# Altium schematic sheet proj_patrusheva_control_board_1.SchDoc: =title_line_1 + title_line_2
size 840 x 594 mm; SheetNumber: n
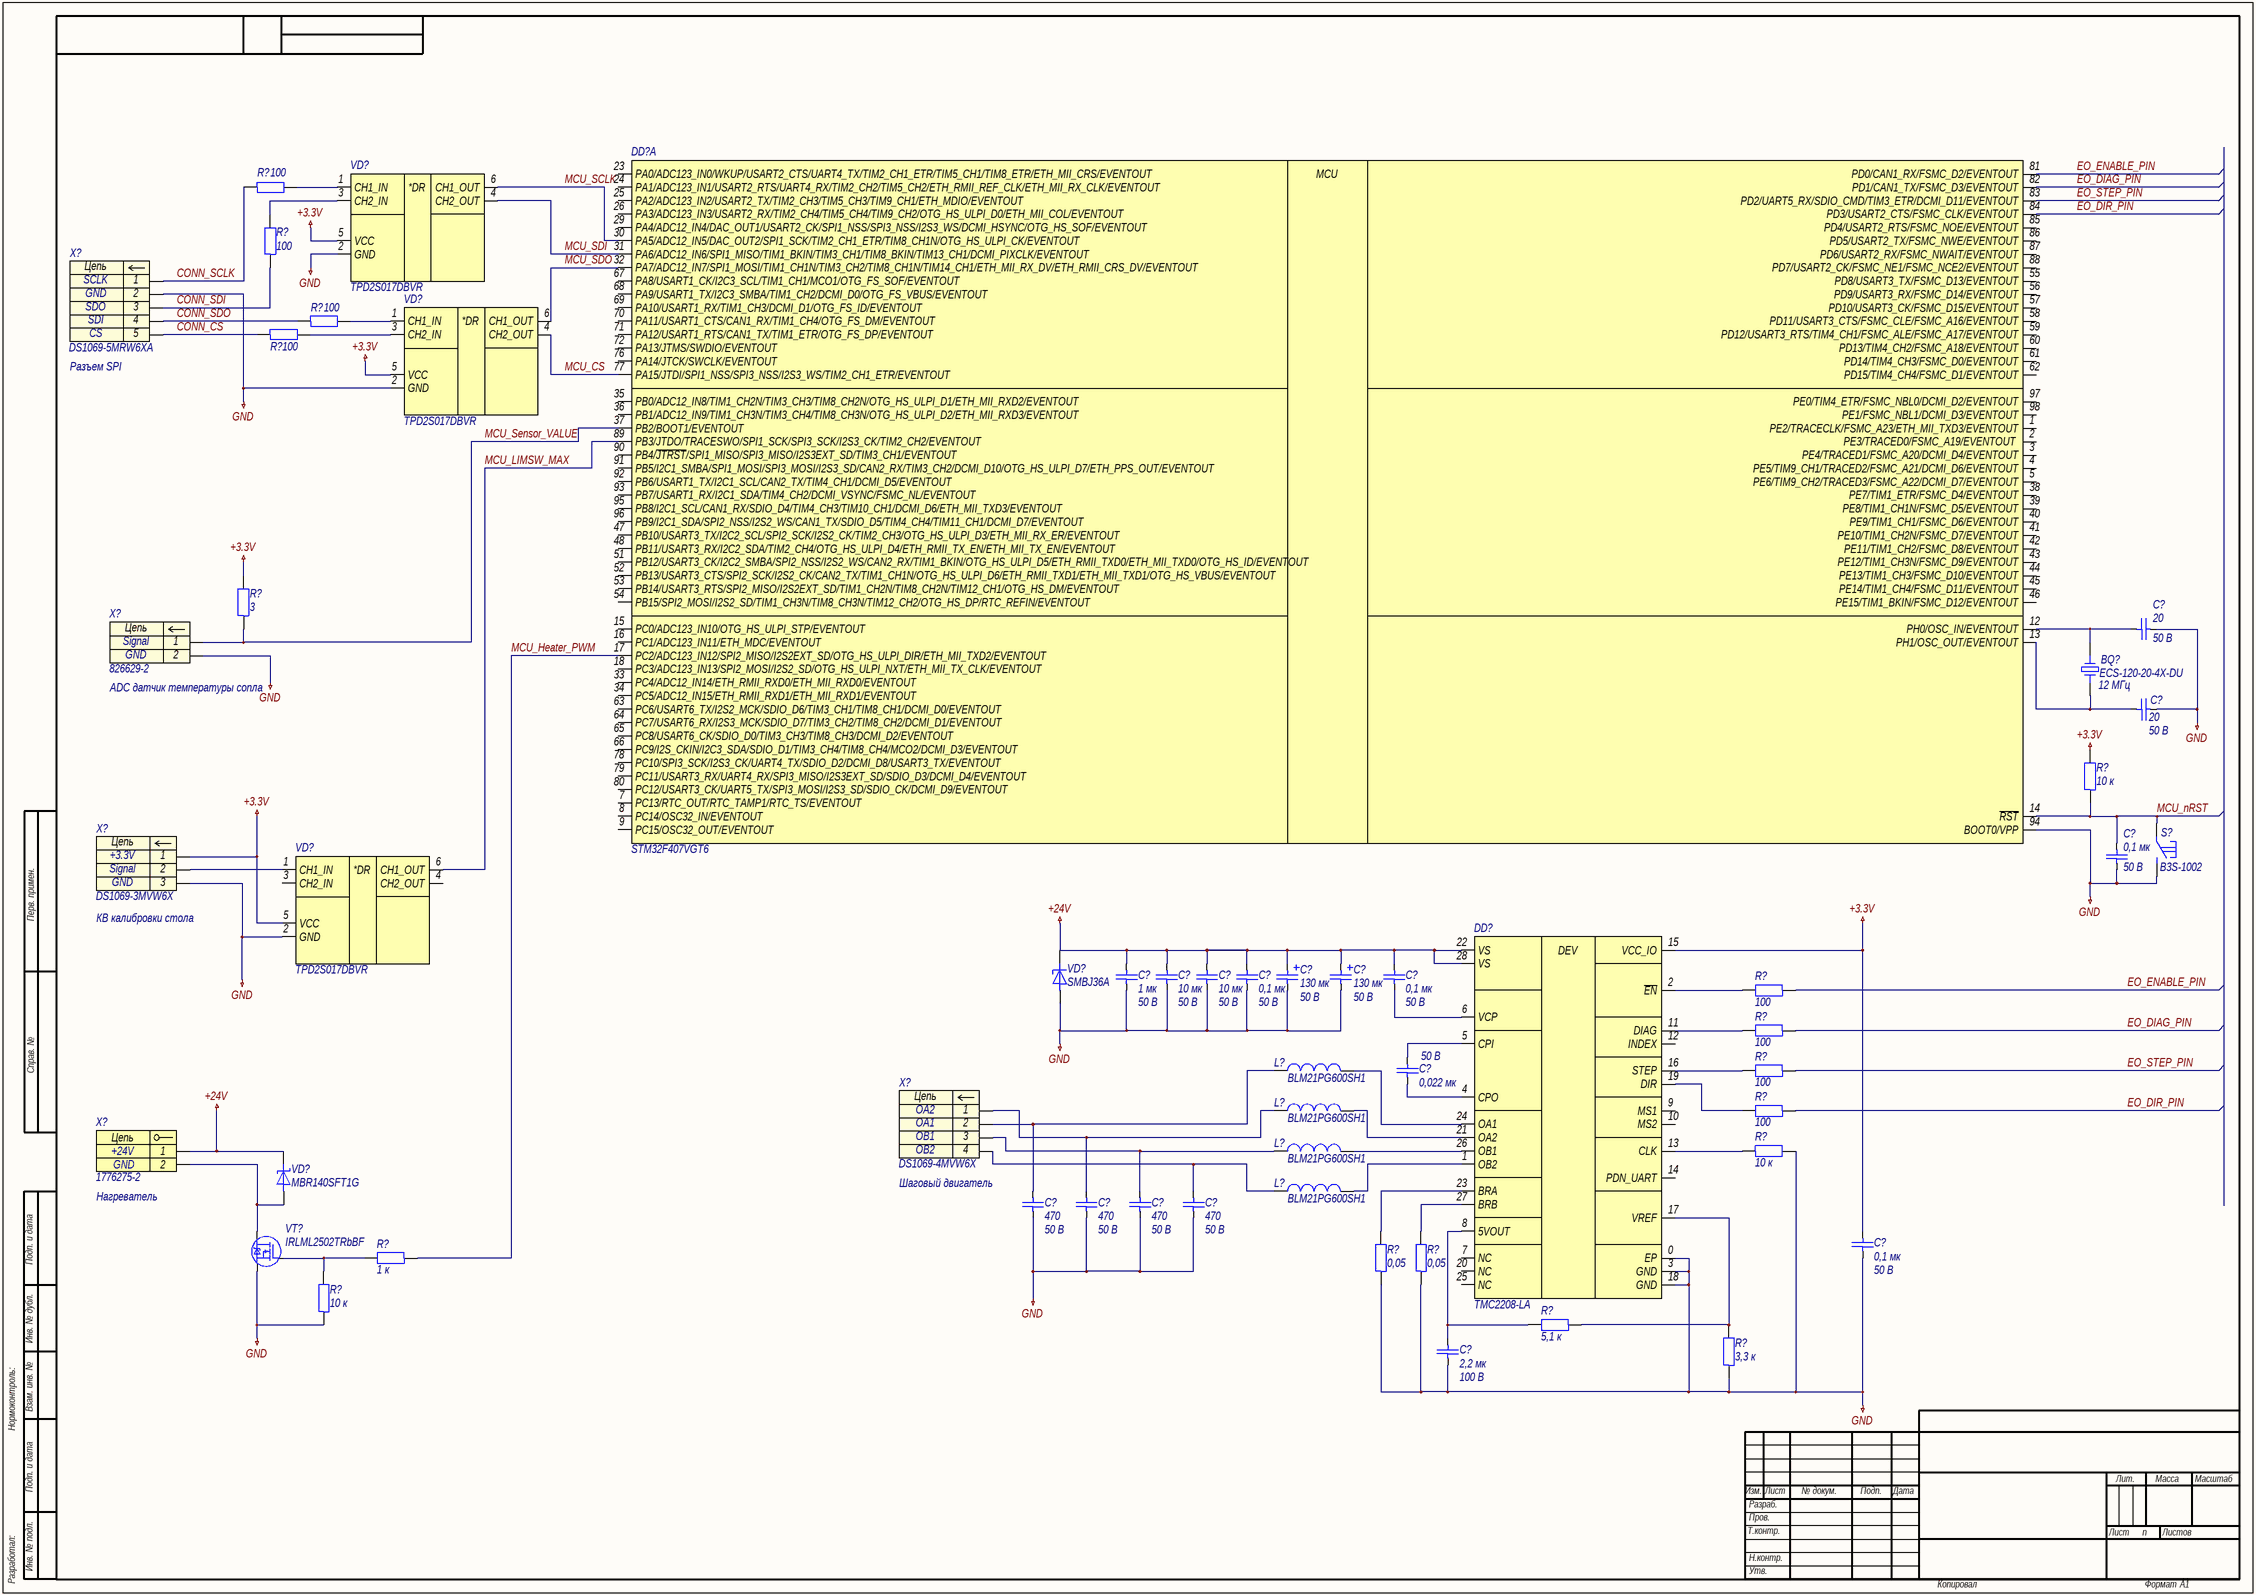
[diagram p0: proj_patrusheva_control_board_1.SchDoc]

## Parts
(Parts that share a designator on the sheet are numbered #1, #2 ... from top to bottom, then left to right.)
BQ?  ECS-120-20-4X-DU  Частотa: 12 МГц  [HC-49/US]
C?#1  20  Напряжение: 50 В  [C0603]
C?#2  20  Напряжение: 50 В  [C0603]
C?#3  0,1 мк  Напряжение: 50 В  [C0603]
C?#4  1 мк  Напряжение: 50 В  [C1210]
C?#5  10 мк  Напряжение: 50 В  [C2220]
C?#6  10 мк  Напряжение: 50 В  [C2220]
C?#7  0,1 мк  Напряжение: 50 В  [C0603]
C?#8  130 мк  Напряжение: 50 В  [C7343-43]
C?#9  130 мк  Напряжение: 50 В  [C7343-43]
C?#10  0,1 мк  Напряжение: 50 В  [C0402]
C?#11  0,022 мк  Напряжение: 50 В  [C0603]
C?#12  470  Напряжение: 50 В  [C0603]
C?#13  470  Напряжение: 50 В  [C0603]
C?#14  470  Напряжение: 50 В  [C0603]
C?#15  470  Напряжение: 50 В  [C0603]
C?#16  0,1 мк  Напряжение: 50 В  [C0402]
C?#17  2,2 мк  Напряжение: 100 В  [C1206]
DD?#1  STM32F407VGT6  [LQFP-100-P50-1400X1400X160-L60X22]  (part A of 2)
DD?#2  TMC2208-LA  [QFN-28-P50-500X500X90-L55X25-T310X310]
L?#1  BLM21PG600SH1  [MI-2-0805]
L?#2  BLM21PG600SH1  [MI-2-0805]
L?#3  BLM21PG600SH1  [MI-2-0805]
L?#4  BLM21PG600SH1  [MI-2-0805]
R?#1  100  [R0603]
R?#2  100  [R0603]
R?#3  100  [R0603]
R?#4  100  [R0603]
R?#5  3  [R0603]
R?#6  10 к  [R0603]
R?#7  100  [R0603]
R?#8  100  [R0603]
R?#9  100  [R0603]
R?#10  100  [R0603]
R?#11  10 к  [R0603]
R?#12  1 к  [R0603]
R?#13  0,05  [R0603]
R?#14  0,05  [R0603]
R?#15  10 к  [R0603]
R?#16  5,1 к  [R0603]
R?#17  3,3 к  [R0603]
S?  B3S-1002  [B3S-1002]
VD?#1  TPD2S017DBVR  [SOT-23-6-P95-290X280X145]
VD?#2  TPD2S017DBVR  [SOT-23-6-P95-290X280X145]
VD?#3  TPD2S017DBVR  [SOT-23-6-P95-290X280X145]
VD?#4  SMBJ36A  [SMBJ36A]
VD?#5  MBR140SFT1G  [SOD-123]
VT?  IRLML2502TRbBF  [SOT-23-3]
X?#1  DS1069-5MRW6XA  [DS1069-5MRW6XA]
X?#2  826629-2  [826629-2]
X?#3  DS1069-3MVW6X  [DS1069-3MVW6X]
X?#4  DS1069-4MVW6X  [DS1069-4MVW6X]
X?#5  1776275-2  [1776275-2]

## Nets
+3.3V: C?#16.1 DD?#2.15(VCC_IO) R?#5.2 R?#6.2 VD?#1.5(VCC) VD?#2.5(VCC) VD?#3.5(VCC) X?#3.1
+24V: C?#4.1 C?#5.1 C?#6.1 C?#7.1 C?#8.1 C?#9.1 C?#10.1 DD?#2.22(VS) DD?#2.28(VS) VD?#4.1 VD?#5.1 X?#5.1
GND: C?#1.1 C?#2.1 C?#3.2 C?#4.2 C?#5.2 C?#6.2 C?#7.2 C?#8.2 C?#9.2 C?#12.2 C?#13.2 C?#14.2 C?#15.2 C?#16.2 C?#17.2 DD?#1.94(BOOT0/VPP) DD?#2.0(EP) DD?#2.3(GND) DD?#2.18(GND) R?#11.2 R?#13.1 R?#14.1 R?#15.1 R?#17.1 S?.2 VD?#1.2(GND) VD?#2.2(GND) VD?#3.2(GND) VD?#4.2 VT?.2(S) X?#1.2 X?#2.2 X?#3.3
CONN_CS: R?#4.1 X?#1.5
CONN_SCLK: R?#1.1 X?#1.1
CONN_SDI: R?#2.1 X?#1.3
CONN_SDO: R?#3.1 X?#1.4
EO_DIAG_PIN: DD?#1.82(PD1/CAN1_TX/FSMC_D3/EVENTOUT) R?#8.1
EO_DIR_PIN: DD?#1.84(PD3/USART2_CTS/FSMC_CLK/EVENTOUT) R?#10.1
EO_ENABLE_PIN: DD?#1.81(PD0/CAN1_RX/FSMC_D2/EVENTOUT) R?#7.1
EO_STEP_PIN: DD?#1.83(PD2/UART5_RX/SDIO_CMD/TIM3_ETR/DCMI_D11/EVENTOUT) R?#9.1
MCU_CS: DD?#1.77(PA15/JTDI/SPI1_NSS/SPI3_NSS/I2S3_WS/TIM2_CH1_ETR/EVENTOUT) VD?#2.4(CH2_OUT)
MCU_Heater_PWM: DD?#1.17(PC2/ADC123_IN12/SPI2_MISO/I2S2EXT_SD/OTG_HS_ULPI_DIR/ETH_MII_TXD2/EVENTOUT) R?#12.1
MCU_LIMSW_MAX: DD?#1.89(PB3/JTDO/TRACESWO/SPI1_SCK/SPI3_SCK/I2S3_CK/TIM2_CH2/EVENTOUT) VD?#3.6(CH1_OUT)
MCU_nRST: C?#3.1 DD?#1.14(~{RST}) R?#6.1 S?.1
MCU_SCLK: DD?#1.30(PA5/ADC12_IN5/DAC_OUT2/SPI1_SCK/TIM2_CH1_ETR/TIM8_CH1N/OTG_HS_ULPI_CK/EVENTOUT) VD?#1.6(CH1_OUT)
MCU_SDI: DD?#1.31(PA6/ADC12_IN6/SPI1_MISO/TIM1_BKIN/TIM3_CH1/TIM8_BKIN/TIM13_CH1/DCMI_PIXCLK/EVENTOUT) VD?#1.4(CH2_OUT)
MCU_SDO: DD?#1.32(PA7/ADC12_IN7/SPI1_MOSI/TIM1_CH1N/TIM3_CH2/TIM8_CH1N/TIM14_CH1/ETH_MII_RX_DV/ETH_RMII_CRS_DV/EVENTOUT) VD?#2.6(CH1_OUT)
MCU_Sensor_VALUE: DD?#1.37(PB2/BOOT1/EVENTOUT) R?#5.1 X?#2.1
NetBQ?_2: BQ?.2 C?#1.2 DD?#1.12(PH0/OSC_IN/EVENTOUT)
NetC?#2_2: C?#2.2 DD?#1.13(PH1/OSC_OUT/EVENTOUT)
NetC?#10_2: C?#10.2 DD?#2.6(VCP)
NetC?#11_1: C?#11.1 DD?#2.5(CPI)
NetC?#11_2: C?#11.2 DD?#2.4(CPO)
NetC?#12_1: C?#12.1 L?#1.1 X?#4.2
NetC?#13_1: C?#13.1 L?#2.1 X?#4.1
NetC?#14_1: C?#14.1 L?#3.1 X?#4.3
NetC?#15_1: C?#15.1 L?#4.1 X?#4.4
NetC?#17_1: C?#17.1 DD?#2.8(5VOUT) R?#16.2
NetDD?#2_1: DD?#2.1(OB2) L?#4.2
NetDD?#2_2: DD?#2.2(~{EN}) R?#7.2
NetDD?#2_11: DD?#2.11(DIAG) R?#8.2
NetDD?#2_13: DD?#2.13(CLK) R?#11.1
NetDD?#2_16: DD?#2.16(STEP) R?#9.2
NetDD?#2_17: DD?#2.17(VREF) R?#16.1 R?#17.2
NetDD?#2_19: DD?#2.19(DIR) R?#10.2
NetDD?#2_21: DD?#2.21(OA2) L?#2.2
NetDD?#2_23: DD?#2.23(BRA) R?#13.2
NetDD?#2_24: DD?#2.24(OA1) L?#1.2
NetDD?#2_26: DD?#2.26(OB1) L?#3.2
NetDD?#2_27: DD?#2.27(BRB) R?#14.2
NetR?#1_2: R?#1.2 VD?#1.1(CH1_IN)
NetR?#2_2: R?#2.2 VD?#1.3(CH2_IN)
NetR?#3_2: R?#3.2 VD?#2.1(CH1_IN)
NetR?#4_2: R?#4.2 VD?#2.3(CH2_IN)
NetR?#12_2: R?#12.2 R?#15.2 VT?.1(G)
NetVD?#3_1: VD?#3.1(CH1_IN) X?#3.2
NetVD?#5_2: VD?#5.2 VT?.3(D) X?#5.2

Not connected (* = marked no-connect by the designer): BQ? 1; DD?#1 1(PE2/TRACECLK/FSMC_A23/ETH_MII_TXD3/EVENTOUT) 2(PE3/TRACED0/FSMC_A19/EVENTOUT_) 3(PE4/TRACED1/FSMC_A20/DCMI_D4/EVENTOUT) 4(PE5/TIM9_CH1/TRACED2/FSMC_A21/DCMI_D6/EVENTOUT) 5(PE6/TIM9_CH2/TRACED3/FSMC_A22/DCMI_D7/EVENTOUT) 7(PC13/RTC_OUT/RTC_TAMP1/RTC_TS/EVENTOUT) 8(PC14/OSC32_IN/EVENTOUT) 9(PC15/OSC32_OUT/EVENTOUT) 15(PC0/ADC123_IN10/OTG_HS_ULPI_STP/EVENTOUT) 16(PC1/ADC123_IN11/ETH_MDC/EVENTOUT) 18(PC3/ADC123_IN13/SPI2_MOSI/I2S2_SD/OTG_HS_ULPI_NXT/ETH_MII_TX_CLK/EVENTOUT) 23(PA0/ADC123_IN0/WKUP/USART2_CTS/UART4_TX/TIM2_CH1_ETR/TIM5_CH1/TIM8_ETR/ETH_MII_CRS/EVENTOUT) 24(PA1/ADC123_IN1/USART2_RTS/UART4_RX/TIM2_CH2/TIM5_CH2/ETH_RMII_REF_CLK/ETH_MII_RX_CLK/EVENTOUT) 25(PA2/ADC123_IN2/USART2_TX/TIM2_CH3/TIM5_CH3/TIM9_CH1/ETH_MDIO/EVENTOUT_) 26(PA3/ADC123_IN3/USART2_RX/TIM2_CH4/TIM5_CH4/TIM9_CH2/OTG_HS_ULPI_D0/ETH_MII_COL/EVENTOUT) 29(PA4/ADC12_IN4/DAC_OUT1/USART2_CK/SPI1_NSS/SPI3_NSS/I2S3_WS/DCMI_HSYNC/OTG_HS_SOF/EVENTOUT) 33(PC4/ADC12_IN14/ETH_RMII_RXD0/ETH_MII_RXD0/EVENTOUT) 34(PC5/ADC12_IN15/ETH_RMII_RXD1/ETH_MII_RXD1/EVENTOUT) 35(PB0/ADC12_IN8/TIM1_CH2N/TIM3_CH3/TIM8_CH2N/OTG_HS_ULPI_D1/ETH_MII_RXD2/EVENTOUT) 36(PB1/ADC12_IN9/TIM1_CH3N/TIM3_CH4/TIM8_CH3N/OTG_HS_ULPI_D2/ETH_MII_RXD3/EVENTOUT) 38(PE7/TIM1_ETR/FSMC_D4/EVENTOUT) 39(PE8/TIM1_CH1N/FSMC_D5/EVENTOUT) 40(PE9/TIM1_CH1/FSMC_D6/EVENTOUT) 41(PE10/TIM1_CH2N/FSMC_D7/EVENTOUT) 42(PE11/TIM1_CH2/FSMC_D8/EVENTOUT) 43(PE12/TIM1_CH3N/FSMC_D9/EVENTOUT) 44(PE13/TIM1_CH3/FSMC_D10/EVENTOUT) 45(PE14/TIM1_CH4/FSMC_D11/EVENTOUT) 46(PE15/TIM1_BKIN/FSMC_D12/EVENTOUT) 47(PB10/USART3_TX/I2C2_SCL/SPI2_SCK/I2S2_CK/TIM2_CH3/OTG_HS_ULPI_D3/ETH_MII_RX_ER/EVENTOUT) 48(PB11/USART3_RX/I2C2_SDA/TIM2_CH4/OTG_HS_ULPI_D4/ETH_RMII_TX_EN/ETH_MII_TX_EN/EVENTOUT) 51(PB12/USART3_CK/I2C2_SMBA/SPI2_NSS/I2S2_WS/CAN2_RX/TIM1_BKIN/OTG_HS_ULPI_D5/ETH_RMII_TXD0/ETH_MII_TXD0/OTG_HS_ID/EVENTOUT) 52(PB13/USART3_CTS/SPI2_SCK/I2S2_CK/CAN2_TX/TIM1_CH1N/OTG_HS_ULPI_D6/ETH_RMII_TXD1/ETH_MII_TXD1/OTG_HS_VBUS/EVENTOUT) 53(PB14/USART3_RTS/SPI2_MISO/I2S2EXT_SD/TIM1_CH2N/TIM8_CH2N/TIM12_CH1/OTG_HS_DM/EVENTOUT) 54(PB15/SPI2_MOSI/I2S2_SD/TIM1_CH3N/TIM8_CH3N/TIM12_CH2/OTG_HS_DP/RTC_REFIN/EVENTOUT) 55(PD8/USART3_TX/FSMC_D13/EVENTOUT) 56(PD9/USART3_RX/FSMC_D14/EVENTOUT) 57(PD10/USART3_CK/FSMC_D15/EVENTOUT) 58(PD11/USART3_CTS/FSMC_CLE/FSMC_A16/EVENTOUT) 59(PD12/USART3_RTS/TIM4_CH1/FSMC_ALE/FSMC_A17/EVENTOUT) 60(PD13/TIM4_CH2/FSMC_A18/EVENTOUT) 61(PD14/TIM4_CH3/FSMC_D0/EVENTOUT) 62(PD15/TIM4_CH4/FSMC_D1/EVENTOUT) 63(PC6/USART6_TX/I2S2_MCK/SDIO_D6/TIM3_CH1/TIM8_CH1/DCMI_D0/EVENTOUT) 64(PC7/USART6_RX/I2S3_MCK/SDIO_D7/TIM3_CH2/TIM8_CH2/DCMI_D1/EVENTOUT) 65(PC8/USART6_CK/SDIO_D0/TIM3_CH3/TIM8_CH3/DCMI_D2/EVENTOUT) 66(PC9/I2S_CKIN/I2C3_SDA/SDIO_D1/TIM3_CH4/TIM8_CH4/MCO2/DCMI_D3/EVENTOUT) 67(PA8/USART1_CK/I2C3_SCL/TIM1_CH1/MCO1/OTG_FS_SOF/EVENTOUT) 68(PA9/USART1_TX/I2C3_SMBA/TIM1_CH2/DCMI_D0/OTG_FS_VBUS/EVENTOUT) 69(PA10/USART1_RX/TIM1_CH3/DCMI_D1/OTG_FS_ID/EVENTOUT) 70(PA11/USART1_CTS/CAN1_RX/TIM1_CH4/OTG_FS_DM/EVENTOUT) 71(PA12/USART1_RTS/CAN1_TX/TIM1_ETR/OTG_FS_DP/EVENTOUT) 72(PA13/JTMS/SWDIO/EVENTOUT) 76(PA14/JTCK/SWCLK/EVENTOUT) 78(PC10/SPI3_SCK/I2S3_CK/UART4_TX/SDIO_D2/DCMI_D8/USART3_TX/EVENTOUT_) 79(PC11/USART3_RX/UART4_RX/SPI3_MISO/I2S3EXT_SD/SDIO_D3/DCMI_D4/EVENTOUT) 80(PC12/USART3_CK/UART5_TX/SPI3_MOSI/I2S3_SD/SDIO_CK/DCMI_D9/EVENTOUT) 85(PD4/USART2_RTS/FSMC_NOE/EVENTOUT) 86(PD5/USART2_TX/FSMC_NWE/EVENTOUT) 87(PD6/USART2_RX/FSMC_NWAIT/EVENTOUT) 88(PD7/USART2_CK/FSMC_NE1/FSMC_NCE2/EVENTOUT) 90(PB4/~{JTRST}/SPI1_MISO/SPI3_MISO/I2S3EXT_SD/TIM3_CH1/EVENTOUT) 91(PB5/I2C1_SMBA/SPI1_MOSI/SPI3_MOSI/I2S3_SD/CAN2_RX/TIM3_CH2/DCMI_D10/OTG_HS_ULPI_D7/ETH_PPS_OUT/EVENTOUT) 92(PB6/USART1_TX/I2C1_SCL/CAN2_TX/TIM4_CH1/DCMI_D5/EVENTOUT) 93(PB7/USART1_RX/I2C1_SDA/TIM4_CH2/DCMI_VSYNC/FSMC_NL/EVENTOUT) 95(PB8/I2C1_SCL/CAN1_RX/SDIO_D4/TIM4_CH3/TIM10_CH1/DCMI_D6/ETH_MII_TXD3/EVENTOUT) 96(PB9/I2C1_SDA/SPI2_NSS/I2S2_WS/CAN1_TX/SDIO_D5/TIM4_CH4/TIM11_CH1/DCMI_D7/EVENTOUT) 97(PE0/TIM4_ETR/FSMC_NBL0/DCMI_D2/EVENTOUT) 98(PE1/FSMC_NBL1/DCMI_D3/EVENTOUT); DD?#2 7(NC) 9(MS1) 10(MS2) 12(INDEX) 14(PDN_UART) 20(NC) 25(NC); VD?#3 3(CH2_IN) 4(CH2_OUT)

## Notes on the sheet
- Разъем SPI
- (near X?#2) ADC датчик температуры сопла
- КВ калибровки стола
- Шаговый двигатель
- Нагреватель
- Перв. примен.
- Справ. №
- Подп. и дата
- Инв. № дубл.
- Нормоконтроль:
- Взам. инв. №
- Изм.
- Лист
- № докум.
- Подп.
- Дата
- Лит.
- Масса
- Масштаб
- Т.контр.
- Пров.
- Разраб.
- Листов
- Разработал:
- Инв. № подл.
- Н.контр.
- Утв.
- Копировал
- Формат
- А1
- (in symbol dd0002) DEV
- (in symbol dd0002, part A) MCU
- (in symbol vd0016) *DR
- (in symbol x0007) Цепь
- (in symbol x0011) Цепь
- (in symbol x0043) Цепь
- (in symbol x0045) Цепь
- (in symbol x0046) Цепь

## Library data of the parts
BQ? = bq0005: =Описание; ID: bq0005; Фамилия: Паньков; Описание: Кварцевый резонатор 12 МГц нагрузочные конденсаторы 20 пФ; Производитель: ECS, Inc. International; Наименование: ECS-120-20-4X-DU; Частота: 12 МГц; Корпус: HC-49/US; HelpURL: https://ecsxtal.com/hc-49usx
C?#1 C?#2 = c0021: =Описание; ID: c0021; Фамилия: Паньков; Описание: Конденсатор керамический чип 0603 20 пФ 50 В ±1 %; Наименование: CC0603FRNPO9BN200; Производитель: YAGEO Corp.; Отклонение: ±1 %; Рабочие температуры: от –55 °С до +125 °С; Температурный коэффициент емкости: C0G; Корпус: 0603; Номинал: 20; Номинальное напряжение: 50 В; HelpURL: https://www.yageo.com/upload/media/product/productsearch/datasheet/mlcc/UPY-GP_NP0_16V-to-50V_18.pdf
C?#3 = c0087: =Описание; ID: c0087; Фамилия: Ларионов; Описание: Конденсатор керамический чип 0603 100 нФ 50 В ±5 %; Наименование: CC0603JRX7R9BB104; Производитель: YAGEO Corp.; Отклонение: ±5 %; Рабочие температуры: от –55 °С до +125 °С; Температурный коэффициент емкости: X7R; Корпус: 0603; Номинал: 0,1 мк; Номинальное напряжение: 50 В; HelpURL: https://www.yageo.com/upload/media/product/productsearch/datasheet/mlcc/UPY-GPHC_X7R_6.3V-to-50V_20.pdf
C?#4 = c0153: =Описание; ID: c0153; Описание: Конденсатор керамический чип 1210 1 мк 50 В ±10 %; Производитель: YAGEO Corp.; Отклонение: ±5 %; Рабочие температуры: от –55 °С до +125 °С; Температурный коэффициент емкости: C0G; Корпус: 1210; Номинал: 1 мк; Номинальное напряжение: 50 В; HelpURL: https://www.yageo.com/upload/media/product/productsearch/datasheet/mlcc/UPY-NP0X7R_MV_100-to-630V_22.pdf
C?#5 C?#6 = c0152: =Описание; ID: c0152; Описание: Конденсатор керамический чип 2220 10 мк 50 В ±2 %; Производитель: KEMET Corporation; Отклонение: ±2 %; Рабочие температуры: от –55 °С до +125 °С; Температурный коэффициент емкости: X7R; Корпус: 2220; Номинал: 10 мк; Номинальное напряжение: 50 В
C?#7 = c0063: =Описание; ID: c0063; Фамилия: Ларионов; Описание: Конденсатор керамический чип 0603 100 нФ 50 В ±5 %; Наименование: CC0603JRX7R9BB104; Производитель: YAGEO Corp.; Отклонение: ±5 %; Рабочие температуры: от –55 °С до +125 °С; Температурный коэффициент емкости: X7R; Корпус: 0603; Номинал: 0,1 мк; Номинальное напряжение: 50 В; HelpURL: https://www.yageo.com/upload/media/product/productsearch/datasheet/mlcc/UPY-GPHC_X7R_6.3V-to-50V_20.pdf
C?#8 C?#9 = c0150: =Описание; ID: c0150; Фамилия: Паньков; Описание: Конденсатор танталовый чип 7343-43 150 мкФ 16 В ±10 %; Наименование: 293D157X9016E2TE3; Производитель: Vishay Intertechnology, Inc.; Отклонение: ±10 %; Эквивалентное последовательное сопротивление: 0,5 Ом; Среднеквадратичный размах пульсации тока: 0,57 А; Рабочие температуры: от –55 °С до +125 °С; Корпус: 7343-43; Номинал: 130 мк; Номинальное напряжение: 50 В; HelpURL: https://www.vishay.com/capacitors/list/product-40002/
C?#10 C?#16 = c0086: =Описание; ID: c0086; Фамилия: Паньков; Описание: Конденсатор керамический чип 0402 100 нФ 50 В ±10 %; Наименование: CC0402KRX5R9BB104; Производитель: YAGEO Corp.; Отклонение: ±10 %; Рабочие температуры: от –55 °С до +85 °С; Температурный коэффициент емкости: X5R; Корпус: 0402; Номинал: 0,1 мк; Номинальное напряжение: 50 В; HelpURL: https://www.yageo.com/upload/media/product/productsearch/datasheet/mlcc/UPY-GPHC_X5R_4V-to-50V_26.pdf
C?#11 = c0071: =Описание; ID: c0071; Фамилия: Паньков; Описание: Конденсатор керамический чип 0603 22 нФ 50 В ±10 %; Наименование: CC0603KRX7R9BB223; Производитель: YAGEO Corp.; Отклонение: ±10 %; Рабочие температуры: от –55 °С до +125 °С; Температурный коэффициент емкости: X7R; Корпус: 0603; Номинал: 0,022 мк; Номинальное напряжение: 50 В; HelpURL: https://www.yageo.com/upload/media/product/productsearch/datasheet/mlcc/UPY-GPHC_X7R_6.3V-to-50V_20.pdf
C?#12-C?#15 = c0033: =Описание; ID: c0033; Фамилия: Паньков; Описание: Конденсатор керамический чип 0603 470 пФ 50 В ±1 %; Наименование: CC0603FRNPO9BN471; Производитель: YAGEO Corp.; Отклонение: ±1 %; Рабочие температуры: от –55 °С до +125 °С; Температурный коэффициент емкости: C0G; Корпус: 0603; Номинал: 470; Номинальное напряжение: 50 В; HelpURL: https://www.yageo.com/upload/media/product/productsearch/datasheet/mlcc/UPY-GP_NP0_16V-to-50V_18.pdf
C?#17 = c0131: =Описание; ID: c0131; Фамилия: Ларионов; Описание: Конденсатор керамический чип 1206 2,2 мкФ 100 В ±10 %; Наименование: CC1206KKX7R0BB225; Производитель: YAGEO Corp.; Отклонение: ±10 %; Рабочие температуры: от –55 °С до +125 °С; Температурный коэффициент емкости: X7R; Корпус: 1206; Номинал: 2,2 мк; Номинальное напряжение: 100 В; HelpURL: https://www.yageo.com/upload/media/product/productsearch/datasheet/mlcc/UPY-NP0X7R_MV_100-to-630V_22.pdf
DD?#1 = dd0002: =Описание; ID: dd0002; Фамилия: Паньков; Описание: ARM Cortex-M4 32-разрядный микроконтроллер 168 МГц 1 Мбайт FLASH-памяти; Производитель: STMicroelectronics; Рабочее напряжение: от 1,8 В до 3,6 В; Максимальная тактовая частота: 168 МГц; Поддерживаемые интерфейсы: CAN, I2C, SDIO, I2S/SPI, UART/USART, USB; Рабочие температуры: от –40 °С до +85 °С; Корпус: LQFP-100; Наименование: STM32F407VGT6; HelpURL: https://www.st.com/en/microcontrollers-microprocessors/stm32f407vg.html
DD?#2 = dd0002: =Описание; ID: dd0002; Фамилия: Паньков; Описание: Драйвер биполярного шагового двигателя 1…256 микрошагов 36 В; Производитель: Trinamic Motion Control GmbH & Co. KG; Рабочее напряжение: от 4,75 В до 36 В; Рабочий ток: 7,5 мА; Выходное напряжение: 5 В; Рабочие температуры: от –40 °С до +125 °С; Корпус: QFN-28; Наименование: TMC2208-LA; HelpURL: https://www.trinamic.com/products/integrated-circuits/details/tmc2208-la/
L?#1-L?#4 = l0004: =Описание; ID: l0004; Фамилия: Самарин; Описание: Ферритовая бусина 60 Ом ±25 %; Производитель: Murata Manufacturing Co., Ltd.; Сопротивление, 100 МГц: 60 Ом; Отклонение, 100 МГц: ±25 %; Сопротивление при постоянном токе: 0,1 Ом; Рабочие температуры: от –55 °С до +125 °С; Корпус: 0805; Наименование: BLM21PG600SH1; HelpURL: https://www.laird.com/products/inductive-components-emc-components-and-ferrite-cores/ferrite-chip-beads/0805-series/mi0805k400r-10
R?#1-R?#4 R?#7-R?#10 = r0052: =Описание; ID: r0052; Фамилия: Самарин; Описание: Резистор чип 0603 100 Ом ±1 % 0,1 Вт; Наименование: RC0603FR‍‐07100RL; Производитель: YAGEO Corp.; Отклонение: ±1 %; Номинальное напряжение: 75 В; Номинальный ток: 1 А; Рабочие температуры: от –55 °С до +155 °С; Корпус: 0603; Примечание: Ряд E24; Номинал: 100; HelpURL: https://www.yageo.com/upload/media/product/productsearch/datasheet/rchip/PYu-RC_Group_51_RoHS_L_11.pdf
R?#5 = r0014: =Описание; ID: r0014; Фамилия: Паньков; Описание: Резистор чип 0603 3 Ом ±1 % 0,1 Вт; Наименование: RC0603FR-073RL; Производитель: YAGEO Corp.; Отклонение: ±1 %; Номинальное напряжение: 75 В; Номинальный ток: 1 А; Рабочие температуры: от –55 °С до +155 °С; Корпус: 0603; Примечание: Ряд E24; Номинал: 3; HelpURL: https://www.yageo.com/upload/media/product/productsearch/datasheet/rchip/PYu-RC_Group_51_RoHS_L_11.pdf
R?#6 R?#11 = r0105: =Описание; ID: r0105; Фамилия: Самарин; Описание: Резистор чип 0603 10 кОм ±1 % 0,1 Вт; Наименование: RC0603FR-0710KL; Производитель: YAGEO Corp.; Отклонение: ±1 %; Номинальное напряжение: 75 В; Номинальный ток: 1 А; Рабочие температуры: от –55 °С до +155 °С; Корпус: 0603; Примечание: Ряд E24; Номинал: 10 к; HelpURL: https://www.yageo.com/upload/media/product/productsearch/datasheet/rchip/PYu-RC_Group_51_RoHS_L_11.pdf
R?#12 = r0031: =Описание; ID: r0031; Фамилия: Ларионов; Описание: Резистор чип 0603 1 кОм ±1 % 0,1 Вт; Наименование: RC0603FR-071KL; Производитель: YAGEO Corp.; Отклонение: ±1 %; Номинальное напряжение: 75 В; Номинальный ток: 1 А; Рабочие температуры: от –55 °С до +155 °С; Корпус: 0603; Примечание: Ряд E24; Номинал: 1 к; HelpURL: https://www.yageo.com/upload/media/product/productsearch/datasheet/rchip/PYu-RC_Group_51_RoHS_L_11.pdf
R?#13 R?#14 = r0002: =Описание; ID: r0002; Фамилия: Ларионов; Описание: Резистор чип 0603 50 мОм ±1 % 0,1 Вт; Наименование: RL0603FR-070R05L; Производитель: YAGEO Corp.; Отклонение: ±1 %; Номинальное напряжение: не указано; Номинальный ток: 2 А; Рабочие температуры: от –55 °С до +155 °С; Корпус: 0603; Номинал: 0,05; HelpURL: https://www.yageo.com/upload/media/product/productsearch/datasheet/rchip/PYu-RL_Group_521_RoHS_L_2.pdf
R?#15 = r0060: =Описание; ID: r0060; Фамилия: Самарин; Описание: Резистор чип 0603 10 кОм ±1 % 0,1 Вт; Наименование: RC0603FR-0710KL; Производитель: YAGEO Corp.; Отклонение: ±1 %; Номинальное напряжение: 75 В; Номинальный ток: 1 А; Рабочие температуры: от –55 °С до +155 °С; Корпус: 0603; Примечание: Ряд E24; Номинал: 10 к; HelpURL: https://www.yageo.com/upload/media/product/productsearch/datasheet/rchip/PYu-RC_Group_51_RoHS_L_11.pdf
R?#16 = r0096: =Описание; ID: r0096; Фамилия: Жернаков; Описание: Резистор чип 0603 5,1 кОм ±1 % 0,1 Вт; Наименование: RC0603FR-075K1L; Производитель: YAGEO Corp.; Отклонение: ±1 %; Номинальное напряжение: 75 В; Номинальный ток: 1 А; Рабочие температуры: от –55 °С до +155 °С; Корпус: 0603; Примечание: Ряд E24; Номинал: 5,1 к; HelpURL: https://www.yageo.com/upload/media/product/productsearch/datasheet/rchip/PYu-RC_Group_51_RoHS_L_11.pdf
R?#17 = r0089: =Описание; ID: r0089; Фамилия: Паньков; Описание: Резистор чип 0603 3,3 кОм ±1 % 0,1 Вт; Наименование: RC0603FR-073K3L; Производитель: YAGEO Corp.; Отклонение: ±1 %; Номинальное напряжение: 75 В; Номинальный ток: 1 А; Рабочие температуры: от –55 °С до +155 °С; Корпус: 0603; Примечание: Ряд E24; Номинал: 3,3 к; HelpURL: https://www.yageo.com/upload/media/product/productsearch/datasheet/rchip/PYu-RC_Group_51_RoHS_L_11.pdf
S? = s0003: =Описание; ID: s0003; Фамилия: Засецкий; Описание: Тактовая кнопка поверхностного монтажа; Производитель: OMRON Corporation; Ток нагрузки: 50 мА @ 24 В; Сопротивление контакта: 100 мОм; Количество контактов: 4; Рабочие температуры: от –25 °С до +70 °С; Промывка: Разрешена; Корпус: 6,00 x 6,60 x 4,30; Наименование: B3S-1002; HelpURL: https://components.omron.com/product-detail?partId=468
VD?#1-VD?#3 = vd0016: =Описание; ID: vd0016; Фамилия: Паньков; Описание: Диодная сборка для подавления помех 5 В; Производитель: Texas Instruments Inc.; Корпус: SOT-23-6; Наименование: TPD2S017DBVR; HelpURL: https://www.ti.com/product/TPD2S017
VD?#4 = vd0031: =Описание; ID: vd0031; Фамилия: Жернаков; Описание: Стабилитрон 36 В; Производитель: Vishay Intertechnology, Inc.; Номинальное напряжение стабилизации: 36 В; Разброс напряжения стабилизации: 40,0…44,2 В; Номинальный ток стабилизации: 1 мА; Рабочие температуры: от –55 °С до +150 °С; Корпус: SMBJ036A; Наименование: SMBJ36A
VD?#5 = vd0002: =Описание; ID: vd0002; Фамилия: Паньков; Описание: Диод Шоттки 40 В 1 А; Производитель: ON Semiconductor; Максимальное прямое напряжение: 0,88 В; Максимальное обратное напряжение: 40 В; Максимальный прямой ток: 1 А; Рабочие температуры: от –55 °С до +125 °С; Наименование: MBR140SFT1G; Корпус: SOD-123; HelpURL: https://www.onsemi.com/products/discretes-drivers/diodes-rectifiers/schottky-diodes-schottky-rectifiers/mbr140sf
VT? = vt0002: =Описание; ID: vt0002; Фамилия: Паньков; Описание: Полевой N-канальный МДП-транзистор 20 В 4,2 А; Производитель: Infineon Technologies AG; Напряжение затвор — исток: ±12 В; Напряжение сток — исток: 20 В; Ток стока: 4,2 А; Сопротивление сток — исток: 0,080 Ом; Рабочие температуры: от –55 °С до +150 °С; Наименование: IRLML2502TRbBF; Корпус: SOT-23-3; HelpURL: https://www.infineon.com/cms/en/product/power/mosfet/12v-300v-n-channel-power-mosfet/irlml2502/
X?#1 = x0046: =Описание; Contact_1: SCLK; Contact_2: GND; Contact_3: SDO; Contact_4: SDI; Contact_5: CS; ID: x0046; Фамилия: Паньков; Описание: CWF 5 pin Type A 2,5 мм вилка угловой; Производитель: Connfly Electronic Co., Ltd.; Наименование: DS1069-5MRW6XA; HelpURL: http://en.connfly.group/product/xVkr=EusQssAN0gN=Aos=mU+UrVkR9kqEAN0gN0MUR+g+NB+A
X?#2 = x0011: =Описание; Contact_1: Signal; Contact_2: GND; ID: x0011; Фамилия: Архипов; Описание: PLS 2 pin 2,54 мм вилка прямой; Производитель: TE Connectivity; Наименование: 826629-2; HelpURL: https://www.te.com/usa-en/product-826629-2.html
X?#3 = x0043: =Описание; Contact_1: +3.3V; Contact_2: Signal; Contact_3: GND; ID: x0043; Фамилия: Паньков; Описание: CWF 3 pin 2,5 мм вилка прямой; Производитель: Connfly Electronic Co., Ltd.; Наименование: DS1069-3MVW6X; HelpURL: http://en.connfly.group/product/xVkr=EusQssAN0gN=Aos=mU+UrVkR9kqEAN0gN0MUR+g+NB+A
X?#4 = x0045: =Описание; Contact_1: OA2; Contact_2: OA1; Contact_3: OB1; Contact_4: OB2; ID: x0045; Фамилия: Паньков; Описание: CWF 4 pin 2,5 мм вилка прямой; Производитель: Connfly Electronic Co., Ltd.; Наименование: DS1069-4MVW6X; HelpURL: http://en.connfly.group/product/xVkr=EusQssAN0gN=Aos=mU+UrVkR9kqEAN0gN0MUR+g+NB+A
X?#5 = x0007: =Описание; Contact_1: +24V; Contact_2: GND; ID: x0007; Фамилия: Паньков; Описание: Terminal Block 2 pin 3,5 мм; Производитель: TE Connectivity; Наименование: 1776275-2; HelpURL: https://www.te.com/usa-en/product-1776275-2.html